# EAGLE design Pure ADSR (EAGLE 9.6.2)

## Sheet 1 of 3
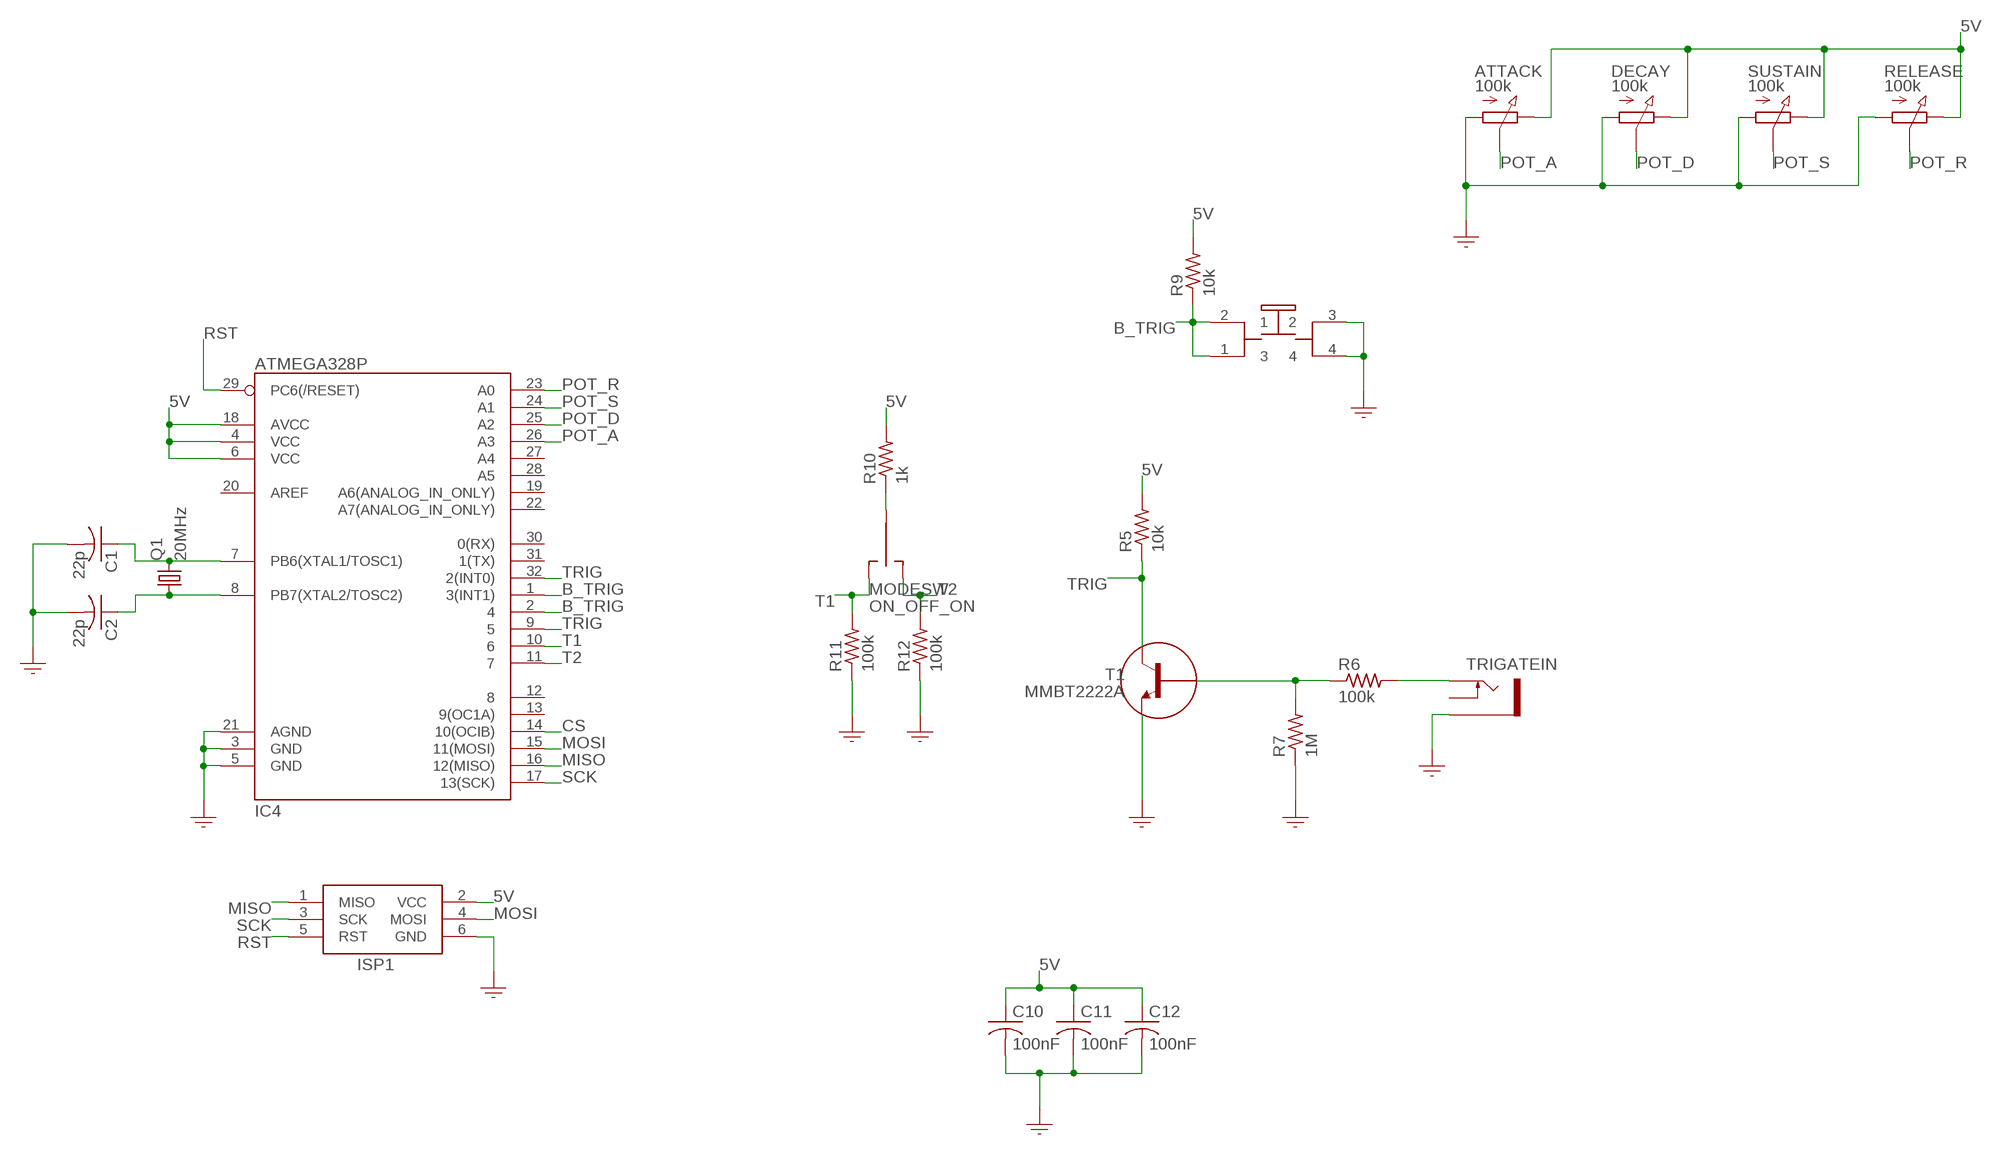
[diagram p0: schematic, sheet 1]

### Parts
ATTACK  100k  RESISTOR_VARIABLE9MM_POT  [POTENTIOMETER_9MM]
C1  22p  CAPACITOR-USC0805  [C0805]
C2  22p  CAPACITOR-USC0805  [C0805]
C10  100nF  CAPACITOR-USC0805  [C0805]
C11  100nF  CAPACITOR-USC0805  [C0805]
C12  100nF  CAPACITOR-USC0805  [C0805]
DECAY  100k  RESISTOR_VARIABLE9MM_POT  [POTENTIOMETER_9MM]
IC4  ATMEGA328P  MICROPROCESSOR_ATMEGA328_SMT  [TQFP32-08]
ISP1  HEADER2X3-6  [AVRISP]
MODESW  ON_OFF_ON  SWITCH_TOGGLE_SPDT  [TOGGLE_SW]
Q1  20MHz  CRYSTALHC49UP  [HC49UP]
R5  10k  RESISTOR_USR0805  [R0805]
R6  100k  RESISTOR_USR0805  [R0805]
R7  1M  RESISTOR_USR0805  [R0805]
R9  10k  RESISTOR_USR0805  [R0805]
R10  1k  RESISTOR_USR0805  [R0805]
R11  100k  RESISTOR_USR0805  [R0805]
R12  100k  RESISTOR_USR0805  [R0805]
RELEASE  100k  RESISTOR_VARIABLE9MM_POT  [POTENTIOMETER_9MM]
SUSTAIN  100k  RESISTOR_VARIABLE9MM_POT  [POTENTIOMETER_9MM]
T1  MMBT2222A  TRANSISTOR_NPNMMBT2222A  [SOT23]
TRIGATEIN  SOCKET_MONO_3.5MMPJ301M-12  [PJ301M-12]
TRIGGER  PB6149L-5  SWITCH_PUSHBUTTON_LED  [PB6149L]

### Nets
5V: ATTACK.P$3 C10.1 C11.1 C12.1 DECAY.P$3 IC4.4(VCC) IC4.6(VCC) IC4.18(AVCC) ISP1.2(VCC) R5.2 R9.2 R10.2 RELEASE.P$3 SUSTAIN.P$3 ; also sheet 2,3
B_TRIG: IC4.1(3(INT1)) IC4.2 R9.1 TRIGGER.1 TRIGGER.2
CS: IC4.14(10(OCIB)) ; also sheet 3
GND: ATTACK.P$1 C1.2 C2.2 C10.2 C11.2 C12.2 DECAY.P$1 IC4.3(GND) IC4.5(GND) IC4.21(AGND) ISP1.6(GND) R7.1 R11.1 R12.1 RELEASE.P$1 SUSTAIN.P$1 T1.2(E) TRIGATEIN.GND(SLEEVE) TRIGGER.3 TRIGGER.4 ; also sheet 2,3
MISO: IC4.16(12(MISO)) ISP1.1(MISO)
MOSI: IC4.15(11(MOSI)) ISP1.4(MOSI) ; also sheet 3
N$1: C1.1 IC4.7(PB6(XTAL1/TOSC1)) Q1.2
N$2: C2.1 IC4.8(PB7(XTAL2/TOSC2)) Q1.1
N$12: MODESW.2(P) R10.1
N$15: R6.1 R7.2 T1.1(B)
N$18: R6.2 TRIGATEIN.TIP
POT_A: ATTACK.P$2 IC4.26(A3)
POT_D: DECAY.P$2 IC4.25(A2)
POT_R: IC4.23(A0) RELEASE.P$2
POT_S: IC4.24(A1) SUSTAIN.P$2
RST: IC4.29(PC6(/RESET)) ISP1.5(RST)
SCK: IC4.17(13(SCK)) ISP1.3(SCK) ; also sheet 3
T1: IC4.10 MODESW.3(S) R11.2
T2: IC4.11 MODESW.1(O) R12.2
TRIG: IC4.9 IC4.32(2(INT0)) R5.1 T1.3(C)
Unconnected: IC4.12 IC4.13(9(OC1A)) IC4.19(A6(ANALOG_IN_ONLY)) IC4.20(AREF) IC4.22(A7(ANALOG_IN_ONLY)) IC4.27(A4) IC4.28(A5) IC4.30(0(RX)) IC4.31(1(TX)) TRIGATEIN.NORM(SWITCH)

## Sheet 2 of 3: Power
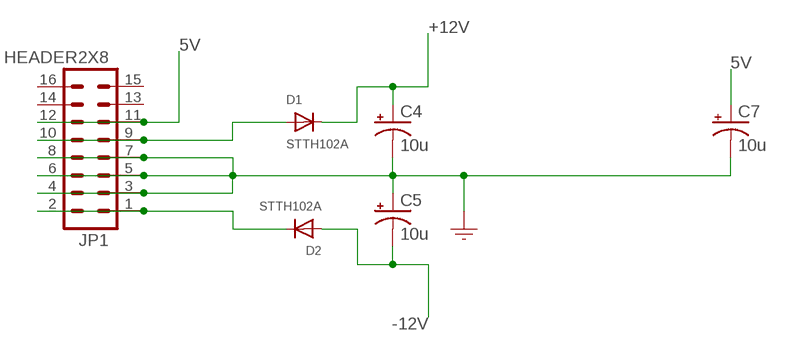
[diagram p1: schematic, sheet 2]

### Parts
C4  10u  CAPACITOR_POL-US153CLV-0505  [153CLV-0505]
C5  10u  CAPACITOR_POL-US153CLV-0505  [153CLV-0505]
C7  10u  CAPACITOR_POL-US153CLV-0505  [153CLV-0505]
D1  STTH102A  DIODESMA  [SMADIODE]
D2  STTH102A  DIODESMA  [SMADIODE]
JP1  HEADER2X8  [POWER_SHROUDED]

### Nets
5V: C7.+ JP1.11 JP1.12 ; also sheet 1,3
+12V: C4.+ D1.C ; also sheet 3
-12V: C5.- D2.A ; also sheet 3
GND: C4.- C5.+ C7.- JP1.3 JP1.4 JP1.5 JP1.6 JP1.7 JP1.8 ; also sheet 1,3
N$13: D2.C JP1.1 JP1.2
N$19: D1.A JP1.9 JP1.10
Unconnected: JP1.13 JP1.14 JP1.15 JP1.16

## Sheet 3 of 3: DAC
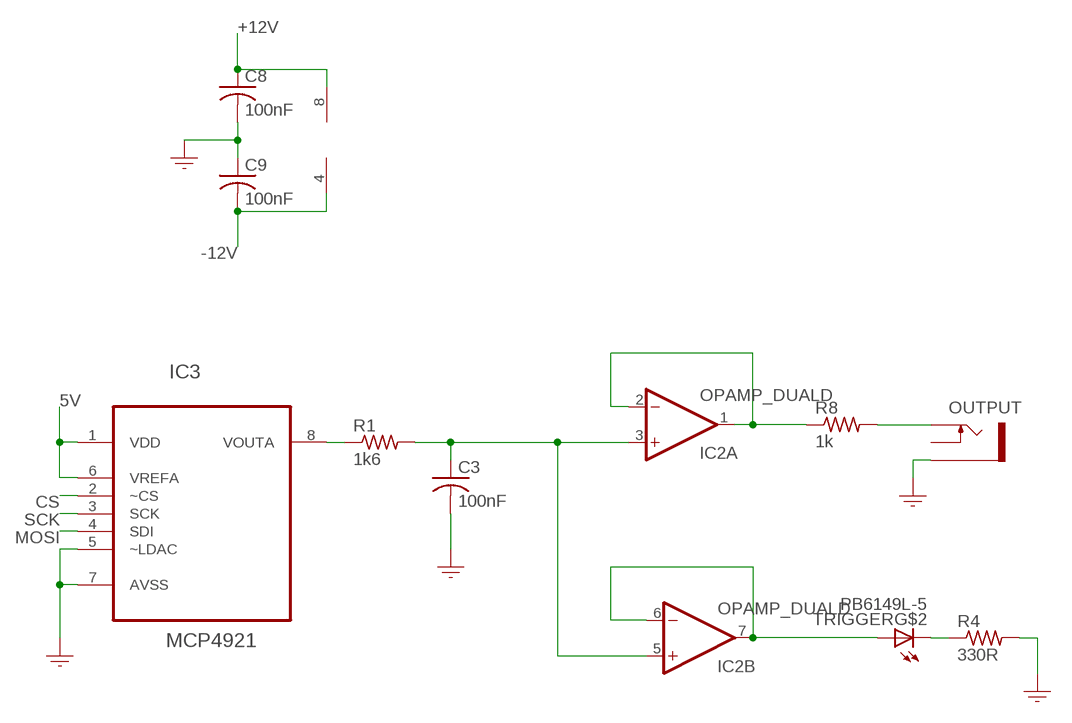
[diagram p2: schematic, sheet 3]

### Parts
C3  100nF  CAPACITOR-USC0805  [C0805]
C8  100nF  CAPACITOR-USC0805  [C0805]
C9  100nF  CAPACITOR-USC0805  [C0805]
IC2  OPAMP_DUALD  [SO08]
IC3  MCP4921  DAC_SINGLE_12B_MCP4921  [SOIC8]
OUTPUT  SOCKET_MONO_3.5MMPJ301M-12  [PJ301M-12]
R1  1k6  RESISTOR_USR0805  [R0805]
R4  330R  RESISTOR_USR0805  [R0805]
R8  1k  RESISTOR_USR0805  [R0805]

### Nets
5V: IC3.1(VDD) IC3.6(VREFA) ; also sheet 1,2
+12V: C8.1 IC2.8(P:V+) ; also sheet 2
-12V: C9.2 IC2.4(P:V-) ; also sheet 2
CS: IC3.2(~CS) ; also sheet 1
GND: C3.2 C8.2 C9.1 IC3.5(~LDAC) IC3.7(AVSS) OUTPUT.GND(SLEEVE) R4.2 ; also sheet 1,2
MOSI: IC3.4(SDI) ; also sheet 1
N$3: IC3.8(VOUTA) R1.1
N$4: C3.1 IC2.3(A:+IN) IC2.5(B:+IN) R1.2
N$5: IC2.1(A:OUT) IC2.2(A:-IN) R8.1
N$7: IC2.6(B:-IN) IC2.7(B:OUT) TRIGGER.A
N$8: R4.1 TRIGGER.K(C)
N$9: OUTPUT.TIP R8.2
SCK: IC3.3(SCK) ; also sheet 1
Unconnected: OUTPUT.NORM(SWITCH)

## Library data of the parts
ATTACK DECAY RELEASE SUSTAIN = GMSN:RESISTOR_VARIABLE: Pot; SORT: 8
C1-C3 C8-C12 = GMSN:CAPACITOR-US: Capacitor; SORT: 3
C4 C5 C7 = GMSN:CAPACITOR_POL-US: Electro Capacitor; SORT: 3
D1 D2 = GMSN:DIODE: Diode SMADIODE - SMA Surface Mount Package 20V 1A Schottky Diode Digikey: 641-1014-6-ND DO-1N4148 - Through Hole Small Current Diode SOD-123 20V 1 A (.5mV Vf) Schottky Diode - Digikey: MBRX120TPMSCT-ND SOD-323 10V 570mA (.38mV Vf, 3ns) Schottky Diode - Digikey: ZLLS410CT-ND SOD-523 30V 30mA Schottky Diode (RB751S-40TE61) - Digikey: RB751S-40TE61CT-ND SOT23-R/W - SOT23 Package (R = Solder Paste/Reflow Ovens, W = Hand-Soldering) BAT54Film 40V 300mA - Digikey: 497-7162-1-ND; SORT: 3.9
IC2 = GMSN:OPAMP_DUAL: Dual Op Amp; SORT: 4.5
IC3 = GMSN:DAC_SINGLE_12B_MCP4921: 12bit DAC; SORT: 4
IC4 = GMSN:MICROPROCESSOR_ATMEGA328_SMT: 32-Pin ATMEGA328 Commonly used on Arduino compatible boards Available in QFP and QFN packages TQFP is IC-09069 QFN is non-stock; SORT: 4
ISP1 = GMSN:HEADER2X3: AVR ISP Header Standard 6 pin header for AVR programming; SORT: 7
JP1 = GMSN:HEADER2X8: 16 Pin Header 2x8; SORT: 7
MODESW = GMSN:SWITCH_TOGGLE_SPDT: On-Off-On Switch; SORT: 9
OUTPUT TRIGATEIN = GMSN:SOCKET_MONO_3.5MM: 3.5 mm Jack Socket; SORT: 8
Q1 = GMSN:CRYSTAL: Crystal; SORT: 5
R1 R4-R12 = GMSN:RESISTOR_US: Resistor; SORT: 2
T1 = GMSN:TRANSISTOR_NPN: Generic NPN BJT MMBT2222A - TRANS-08049 (SOT-23, 1A 40V) MPSA42 - TRANS-09116 (SOT-23, 500mA 300V) MMBT5088LT1G - TRANS-11160 (SOT-23, 50 mA 30V); SORT: 4
TRIGGER = GMSN:SWITCH_PUSHBUTTON_LED: Pushbutton LED; SORT: 9

## Board
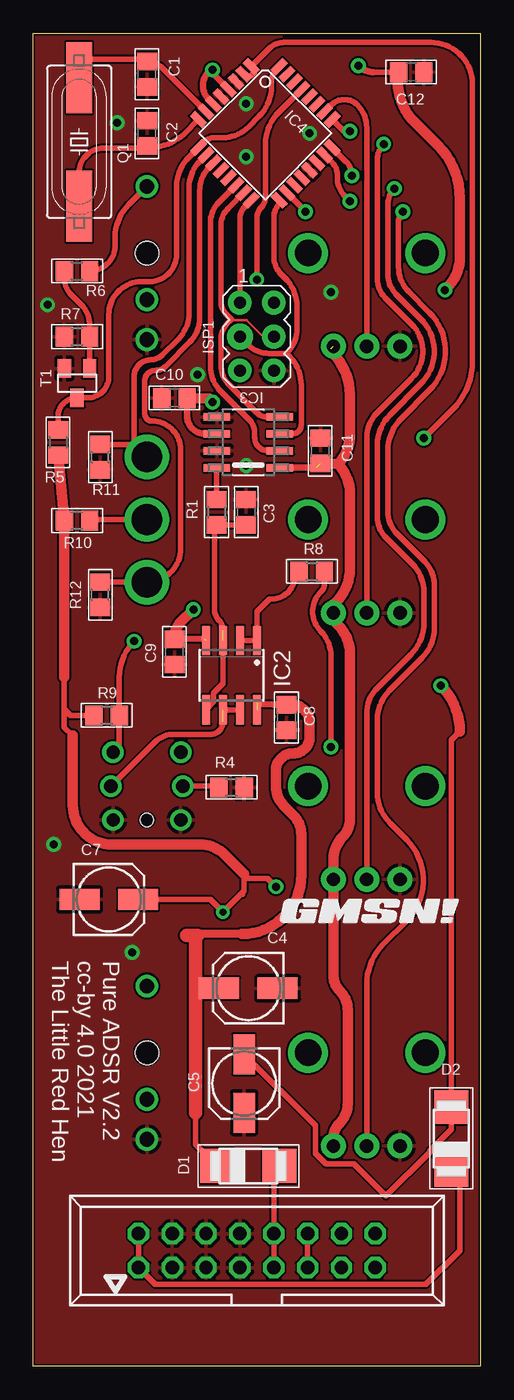
[diagram p3: board, top side]
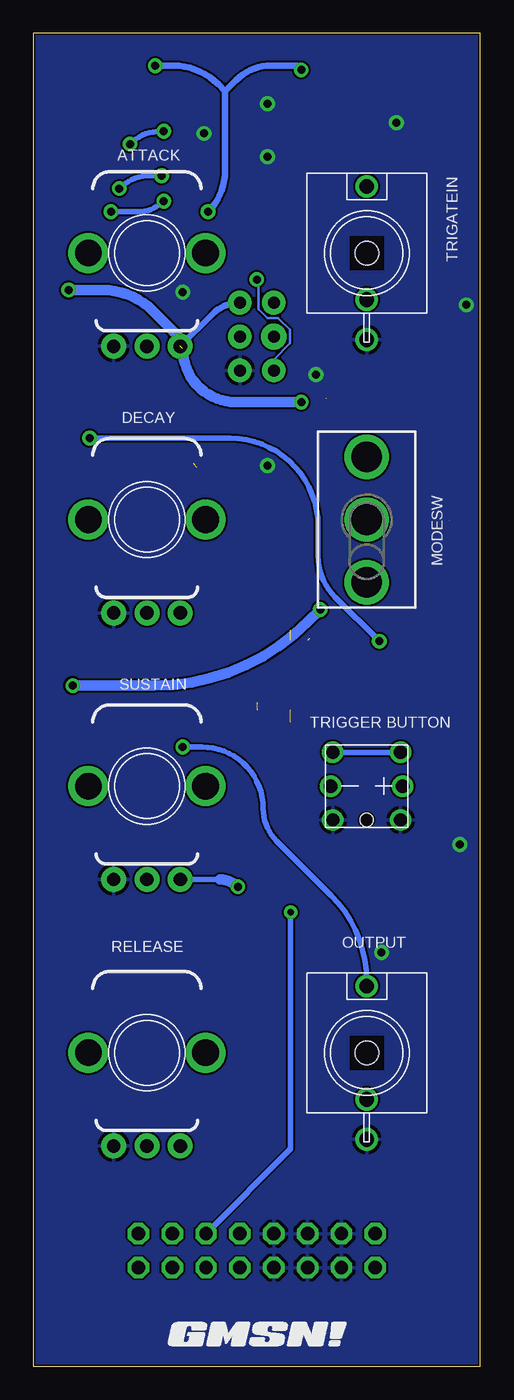
[diagram p4: board, bottom side, seen from below]

Size 33.56 x 100 mm. Coordinates in mm from the lower left corner, seen from the top.
Outline: 33.56,0 0,0 0,100 33.56,100 33.56,0
Copper layers (1*16): Top 0.035mm / dielectric 1.5mm / Bottom 0.035mm
Design rules "PCBWay": minimum track width 6mil, minimum drill 12mil, track to track 6mil, track to pad 6mil, pad to pad 6mil, via to via 6mil, smd to smd 6mil, copper to edge 6mil, drill to drill 6mil, minimum pad ring 12mil, minimum via ring 10mil, stop-mask expansion 4mil, vias tented up to drill 25mil, thermal gap 10mil

### Footprints (pad centres in the part's own frame; a part is rotated, then mirrored left to right if it is on the bottom)
POTENTIOMETER_9MM = drill 1 pad 1.88: P$1 -2.5,-7; P$2 0,-7; P$3 2.5,-7 | drill 2 pad 2.68: P$4 -4.4,0; P$5 4.4,0
C0805 = smd 1.3 x 1.5: 1 -0.95,0; 2 0.95,0
153CLV-0505 = smd 3 x 1.6: + 2.2,0; - -2.2,0
SMADIODE = smd 2.54 x 2.54: A 2.349,0; C -2.349,0
SO08 = smd 0.6 x 2.2: 1 -1.905,-2.6; 2 -0.635,-2.6; 3 0.635,-2.6; 4 1.905,-2.6; 5 1.905,2.6; 6 0.635,2.6; 7 -0.635,2.6; 8 -1.905,2.6
SOIC8 = smd 1.981 x 0.559: 1 -2.362,1.905; 2 -2.362,0.635; 3 -2.362,-0.635; 4 -2.362,-1.905; 5 2.362,-1.905; 6 2.362,-0.635; 7 2.362,0.635; 8 2.362,1.905
TQFP32-08 = smd 1.27 x 0.559: 1 -4.293,2.8; 2 -4.293,2; 3 -4.293,1.2; 4 -4.293,0.4; 5 -4.293,-0.4; 6 -4.293,-1.2; 7 -4.293,-2; 8 -4.293,-2.8; 17 4.293,-2.8; 18 4.293,-2; 19 4.293,-1.2; 20 4.293,-0.4; 21 4.293,0.4; 22 4.293,1.2; 23 4.293,2; 24 4.293,2.8 | smd 0.559 x 1.27: 9 -2.8,-4.293; 10 -2,-4.293; 11 -1.2,-4.293; 12 -0.4,-4.293; 13 0.4,-4.293; 14 1.2,-4.293; 15 2,-4.293; 16 2.8,-4.293; 25 2.8,4.293; 26 2,4.293; 27 1.2,4.293; 28 0.4,4.293; 29 -0.4,4.293; 30 -1.2,4.293; 31 -2,4.293; 32 -2.8,4.293
AVRISP = drill 0.9 pad 1.778: 1 -1.27,2.54; 2 1.27,2.54; 4 1.27,0; 5 -1.27,-2.54; 6 1.27,-2.54 | drill 0.9 pad 1.93: 3 -1.27,0
POWER_SHROUDED = drill 1 octagon: 1 -8.89,-1.27; 2 -8.89,1.27; 3 -6.35,-1.27; 4 -6.35,1.27; 5 -3.81,-1.27; 6 -3.81,1.27; 7 -1.27,-1.27; 8 -1.27,1.27; 9 1.27,-1.27; 10 1.27,1.27; 11 3.81,-1.27; 12 3.81,1.27; 13 6.35,-1.27; 14 6.35,1.27; 15 8.89,-1.27; 16 8.89,1.27
TOGGLE_SW = drill 2.3: 1 -4.7,0; 2 0,0; 3 4.7,0
PJ301M-12 = drill 1.1: GND 0,-6.5; NORM 0,-3.5; TIP 0,5 | hole 1.778: 0,0
HC49UP = smd 5.334 x 1.93: 1 -4.826,0; 2 4.826,0
R0805 = smd 1.3 x 1.5: 1 -0.95,0; 2 0.95,0
SOT23 = smd 1 x 1.4: 1 -0.95,-1.1; 2 0.95,-1.1; 3 0,1.1
PB6149L = drill 1: 1 2.54,-2.54; 2 2.54,2.54; 3 -2.54,-2.54; 4 -2.54,2.54; A 0,-2.7; K 0,2.7 | hole 1: -2.54,0

### Placement (x,y rotation side)
ATTACK  25.03,83.52 0 bottom
C1  8.53,96.94 270 top
C2  8.53,92.49 90 top
C3  15.99,64.07 90 top
C4  16.14,28.36 180 top
C5  15.83,21.21 270 top
C7  5.67,35.02 0 top
C8  19,48.67 270 top
C9  10.59,53.6 90 top
C10  10.59,72.65 180 top
C11  21.54,68.68 90 top
C12  28.37,97.09 0 top
D1  16.14,15.02 0 top
D2  31.38,17.08 90 top
DECAY  25.03,63.52 0 bottom
IC2  14.88,51.85 180 top
IC3  16.14,69.31 180 top
IC4  17.41,92.49 315 top
ISP1  16.78,77.25 0 top
JP1  16.78,8.67 0 top
MODESW  8.53,63.52 90 bottom
OUTPUT  8.53,23.52 0 bottom
Q1  3.45,91.85 90 top
R1  13.76,64.07 270 top
R4  14.88,43.44 0 top
R5  1.86,69.31 270 top
R6  3.29,82.17 0 top
R7  3.29,77.25 0 top
R8  20.91,59.63 0 top
R9  5.51,48.83 180 top
R10  3.29,63.44 180 top
R11  5.03,68.2 90 top
R12  5.03,57.88 90 top
RELEASE  25.03,23.52 0 bottom
SUSTAIN  25.03,43.52 0 bottom
T1  3.29,73.76 180 top
TRIGATEIN  8.53,83.52 0 bottom
TRIGGER  8.53,43.52 90 bottom
U$1  [GMSN!_LOGO]  16.46,2.32 0 bottom
U$2  [GMSN!_LOGO]  25.51,34.07 0 top

### Tracks (layer width: path | path; a pad name or v marks a point on that pad's centre or on a via)
5V  (via drill 0.51, 0.6)  (5 unrouted)
  Top 0.406: JP1.12 JP1.11 | 15.57,35.41 v14.24,34.07 13.29,35.02 C7.+ | 15.57,35.41 15.71,35.41 | 15.83,36.93 15.83,36.61 | 15.83,36.61 15.83,35.66 15.57,35.41 | 15.83,36.61 17.57,36.61 v18.21,35.97 | 2.34,51.85 2.34,49.31 | 2.34,49.31 2.34,47.93 2.97,47.3 | R9.2 2.81,48.83 2.34,49.31 | 25.55,97.09 C12.1 | DECAY.P$3 22.5,56.55
  Top 0.5: IC3.1 21.27,67.41 | IC3.6 12.91,69.95 arc-90 11.54,71.31 11.54,72.6 | IC4.6 13.17,95.04 arc-90 13.17,97.14 13.29,97.25 v13.45,97.25 13.45,97.02 IC4.4 | v24.4,97.57 arc45 25.55,97.09 | IC4.18 20.43,86.64 v20.43,86.62
  Top 0.8: RELEASE.P$3 22.5,16.55 22.5,17.04 arc-45 22.97,18.2 arc45 23.61,19.72 23.61,26.73 arc45 23.02,28.15 arc-45 22.53,29.33 SUSTAIN.P$3 22.53,38.02 arc-45 23.25,39.74 arc45 23.77,41 23.77,53.5 arc45 22.91,55.56 22.5,55.98 22.5,56.48 DECAY.P$3 | 15.83,36.93 14.4,38.35 arc45 12.47,39.15 5.89,39.15 arc-90 2.97,42.07 2.97,47.3 | R10.2 2.34,51.85 2.34,51.7 | R5.2 2.33,63.6 R10.2 | 22.5,56.55 22.5,57.09 22.74,57.34 arc45 23.77,59.8 23.77,65.49 arc45 22.86,67.68 | 22.86,67.68 C11.1 | 22.5,76.48 22.5,75.98 arc-45 23.77,72.91 23.77,69.86 arc-45 22.86,67.68 | C12.1 27.37,96.35 arc45 28.6,93.37 30.38,91.59 arc-45 32.02,87.63 32.02,83.24 arc-45 31.04,80.87 v30.91,80.74 | C10.1 13.18,72.6 v13.45,72.33
  Bottom 0.406: JP1.12 14.24,16.29 v14.24,34.07 | 19.52,36.52 SUSTAIN.P$3 | 20.12,78.93 ATTACK.P$3 22.53,77.13
  Bottom 0.5: ISP1.2 arc-45 20.12,78.93 | v13.45,97.25 13.76,97.57 15.74,97.57 arc-45 18.33,96.5 19.16,95.66 | 19.16,95.66 19.67,96.17 arc-45 23.04,97.57 v24.4,97.57 | v20.43,86.62 arc-45 19.16,89.68 19.16,95.66
  Bottom 0.8: v18.21,35.97 arc-45 19.52,36.52 | v30.91,80.74 28.38,80.74 arc45 24.57,79.16 22.53,77.13 | v13.45,72.33 18.34,72.33 arc90 22.34,76.33
+12V  (1 unrouted)
  Top 0.406: D1.C 12.18,16.64 12.18,19.01 | 12.18,28.99 13.31,28.99 C4.+
  Top 0.5: 16.78,49.79 16.89,49.67 C8.1
  Top 0.61: 15.68,32.42 11.62,32.42 11.52,32.32
  Top 0.8: D1.C 13.95,15.17 | 15.68,32.42 arc90 20.11,36.86 20.11,39.91 arc45 19.53,41.33 18.82,42.04 arc-45 18.21,43.5 18.21,44.68 arc-90 19.51,45.98 arc90 20.75,47.22 20.75,48.28 arc90 19.4,49.63 19.05,49.63 C8.1
  Top 1.016: 12.18,19.01 12.18,28.99 12.18,32.17 12.34,32.32 11.52,32.32
-12V  (via drill 0.6)  (1 unrouted)
  Top 0.406: C5.- 21.18,18.05 21.18,15.96 21.97,15.17 24.07,15.17 26.47,12.77 29.76,16.05 29.76,16.15 31.38,17.78 D2.A 31.38,46.97 32.02,47.61
  Top 0.5: 12.82,54.6 C9.2
  Top 0.8: 32.02,47.61 arc45 v30.59,51.06 | v12.02,56.77 11.1,55.86 arc45 10.59,54.62 C9.2
  Bottom 0.8: v30.59,51.06 24.53,51.06 arc-45 12.92,55.86 v12.02,56.77
B_TRIG  (via drill 0.6)
  Top 0.4: v7.57,54.39 arc45 6.46,51.7 R9.1 6.46,46.53 TRIGGER.1 | v29.32,69.63 31.48,71.79 arc45 32.97,75.38 32.97,96.17 arc90 29.83,99.32 18.82,99.32 arc45 17.71,98.85 IC4.1 16.62,97.25 16.62,97.09 16.3,96.78 16.12,96.62 IC4.2
  Bottom 0.4: v7.57,54.39 10.91,57.72 arc45 12.18,60.79 12.18,63.01 arc-90 18.8,69.63 v29.32,69.63 | TRIGGER.1 TRIGGER.2
CS
  Top 0.4: IC4.14 13.94,87.32 arc45 13.29,85.74 13.29,75.04 arc45 14.08,73.12 16.26,70.95 arc-45 16.62,70.07 16.62,69.69 arc90 17.64,68.68 IC3.2
GND  (via drill 0.6)
  other vias: 1.06,79.63 1.54,39.15 7.41,31.05 12.34,74.39 15.99,67.57 22.34,80.58 20.75,92.49 15.99,94.71 15.99,90.74 6.3,93.28
  pour Bottom: 33.56,100 0,100 0,0 33.56,0
  pour Top: 33.56,100 0,100 0,0 33.56,0
MISO
  Top 0.4: IC4.16 15.89,87 arc45 15.51,86.09 ISP1.1
MOSI
  Top 0.2: ISP1.4 17.23,77.25 16.01,78.47 14.93,78.47 14.88,78.52
  Top 0.4: IC4.15 14.64,86.89 arc45 14.08,85.54 14.08,79.91 arc45 14.5,78.89 14.88,78.52 14.56,78.2 arc45 14.08,77.05 14.08,75.09 arc45 14.69,73.63 16.76,71.56 arc45 17.58,71.22 IC3.4
N$1
  Top 0.4: IC4.7 9.58,97.5 arc45 C1.1 8.41,98.05 3.6,98.05 3.45,97.89 Q1.2
N$2
  Top 0.4: IC4.8 11.3,92.45 arc-45 8.99,91.49 C2.1 8.41,91.38 5.25,91.38 arc90 3.45,89.57 Q1.1
N$3
  Top 0.4: IC3.8 13.76,67.39 R1.1
N$4  (1 unrouted)
  Top 0.4: C3.1 R1.2 13.61,62.96 13.61,56.77 arc45 13.94,55.96 arc-45 14.24,55.24
  Top 0.406: IC2.5 13.53,49.81 13.53,50.52 14.24,51.22 IC2.3
N$5
  Top 0.4: 17.46,57.3 17.73,57.56 17.89,57.56 arc90 19.64,59.31 R8.1
  Top 0.406: 17.46,57.3 16.78,56.61 IC2.1 IC2.2
N$7  (1 unrouted)
  Top 0.4: 14.24,48.33 arc-90 13.31,47.41 10.52,47.41 arc45 9.14,46.83 TRIGGER.A
  Top 0.406: IC2.6 IC2.7
N$8
  Top 0.4: TRIGGER.K 13.84,43.52 R4.1
N$9  (via drill 0.6)
  Top 0.4: v22.34,46.45 22.34,53.31 arc45 21.57,55.15 arc-90 21.57,58.07 arc45 21.86,58.77 R8.2
  Bottom 0.4: v22.34,46.45 20.91,46.45 arc90 16.3,41.85 arc-45 15.29,39.41 11.21,35.32 arc45 8.53,28.86 OUTPUT.TIP
N$12
  Top 0.4: R10.1 4.32,63.52 MODESW.2
N$13
  Top 0.406: JP1.2 JP1.1 9.16,6.13 29.48,6.13 32.02,8.67 32.02,14.1 D2.C
N$15
  Top 0.4: R6.1 2.34,81.62 arc45 2.85,80.39 3.61,79.63 arc-45 4.24,78.1 R7.2 T1.1
N$18
  Top 0.4: TRIGATEIN.TIP 7.16,87.15 arc45 6.14,84.69 6.14,84.08 arc-90 R6.2
N$19
  Top 0.406: JP1.9 JP1.10 18.05,14.41 18.66,15.02
  Top 1.016: 18.66,15.02 D1.A
POT_A
  Top 0.4: ATTACK.P$2 25.03,92.92 arc45 24.32,94.63 arc90 22.39,94.63 IC4.26
POT_D  (via drill 0.6)
  Top 0.4: DECAY.P$2 25.03,69.71 arc-45 25.76,71.46 28.4,74.11 arc90 28.4,78.17 26.39,80.18 arc-45 25.83,81.54 25.83,90.55 arc-45 v26.3,91.7 | v23.77,92.65 23.33,92.65 IC4.25
  Bottom 0.4: v26.3,91.7 arc45 24,92.65 v23.77,92.65
POT_R  (via drill 0.6)
  Top 0.4: RELEASE.P$2 25.03,28.63 arc-45 26.29,31.67 28.03,33.41 arc90 28.03,39.49 26.81,40.71 arc-45 25.83,43.07 25.83,48.52 arc-45 26.72,50.68 29.18,53.14 arc45 30.11,55.39 30.11,58.6 arc45 29.39,60.36 27.32,62.42 arc-45 26.62,64.11 26.62,68.68 arc-45 27.63,71.11 29.74,73.22 arc90 29.74,79.06 28.19,80.61 arc-45 27.42,82.47 27.42,85.85 arc-45 v27.73,86.62 | v23.77,87.41 23.42,87.76 arc-45 22.81,89.22 22.81,89.45 arc45 22.48,90.25 IC4.23
  Bottom 0.4: v27.73,86.62 25.68,86.62 arc-45 v23.77,87.41
POT_S  (via drill 0.6)
  Top 0.4: SUSTAIN.P$2 25.03,48.97 arc-45 25.83,50.9 28.34,53.41 arc45 29.32,55.77 29.32,58.1 arc45 28.47,60.17 26.48,62.15 arc-45 25.83,63.72 25.83,69.12 arc-45 26.75,71.35 29.07,73.67 arc90 29.07,78.61 27.23,80.45 arc-45 26.62,81.92 26.62,87.21 arc-45 v27.1,88.36 | v23.92,89.31 arc45 23.48,90.38 IC4.24
  Bottom 0.4: v27.1,88.36 arc45 24.8,89.31 v23.92,89.31
RST  (via drill 0.6)
  Top 0.4: IC4.29 18.43,94.07 arc45 17.41,91.63 17.41,87.65 arc-45 17.13,86.97 arc45 16.78,86.12 v16.78,81.54
  Bottom 0.2: ISP1.5 15.51,75.53 14.29,76.75 14.29,77.75 15.19,78.65 15.98,78.65 16.65,79.32 16.65,81.41 v16.78,81.54
SCK
  Top 0.4: ISP1.3 16.12,76.64 arc45 17.71,75.98 19,75.98 | 19,75.98 19.05,76.02 arc45 19.8,77.83 19.8,79.49 arc45 18.91,81.63 18.61,81.93 arc-45 18.05,83.28 18.05,86.18 arc-45 18.47,87.19 IC4.17 | IC3.3 19.44,69.95 arc90 20.11,70.62 20.11,73.6 arc45 19.22,75.76 19,75.98
T1
  Top 0.4: IC4.10 12.5,90.41 arc45 11.7,88.47 11.7,79.03 arc-45 10.89,77.07 9.68,75.87 arc-45 8.8,75.5 arc90 7.57,74.27 7.57,69.18 7.6,69.15 | R11.2 7.6,69.15 | 7.6,69.15 MODESW.3
T2
  Top 0.4: IC4.11 13.24,90.01 arc45 12.49,88.21 12.49,78.63 arc-45 11.74,76.82 9.97,75.05 arc-45 9.16,74.71 arc90 8.37,73.92 8.37,71.47 arc90 8.94,70.9 arc-90 11.06,68.77 11.06,61.35 arc-90 8.54,58.83 MODESW.1 8.52,58.83 R12.2
TRIG
  Top 0.4: R5.1 1.86,71.23 arc-90 T1.3 4.09,72.66 arc90 5.67,74.24 5.67,78.89 arc-90 8.15,81.38 8.71,81.38 arc90 10.75,83.41 10.75,88.46 arc-45 11.68,90.72 IC4.9 12.81,91.85 arc-45 13.6,92.17 14.23,92.17 arc45 16.14,92.96 16.96,93.78 arc45 17.89,96.03 17.89,96.52 arc-45 18.18,97.23 IC4.32

### Text on the board
tPlace: T1 | Pure ADSR V2.2 / cc-by 4.0 2021 / The Little Red Hen
bPlace: ATTACK | DECAY | SUSTAIN | TRIGGER BUTTON | RELEASE